# Altium project Assignment 1.PrjPcb
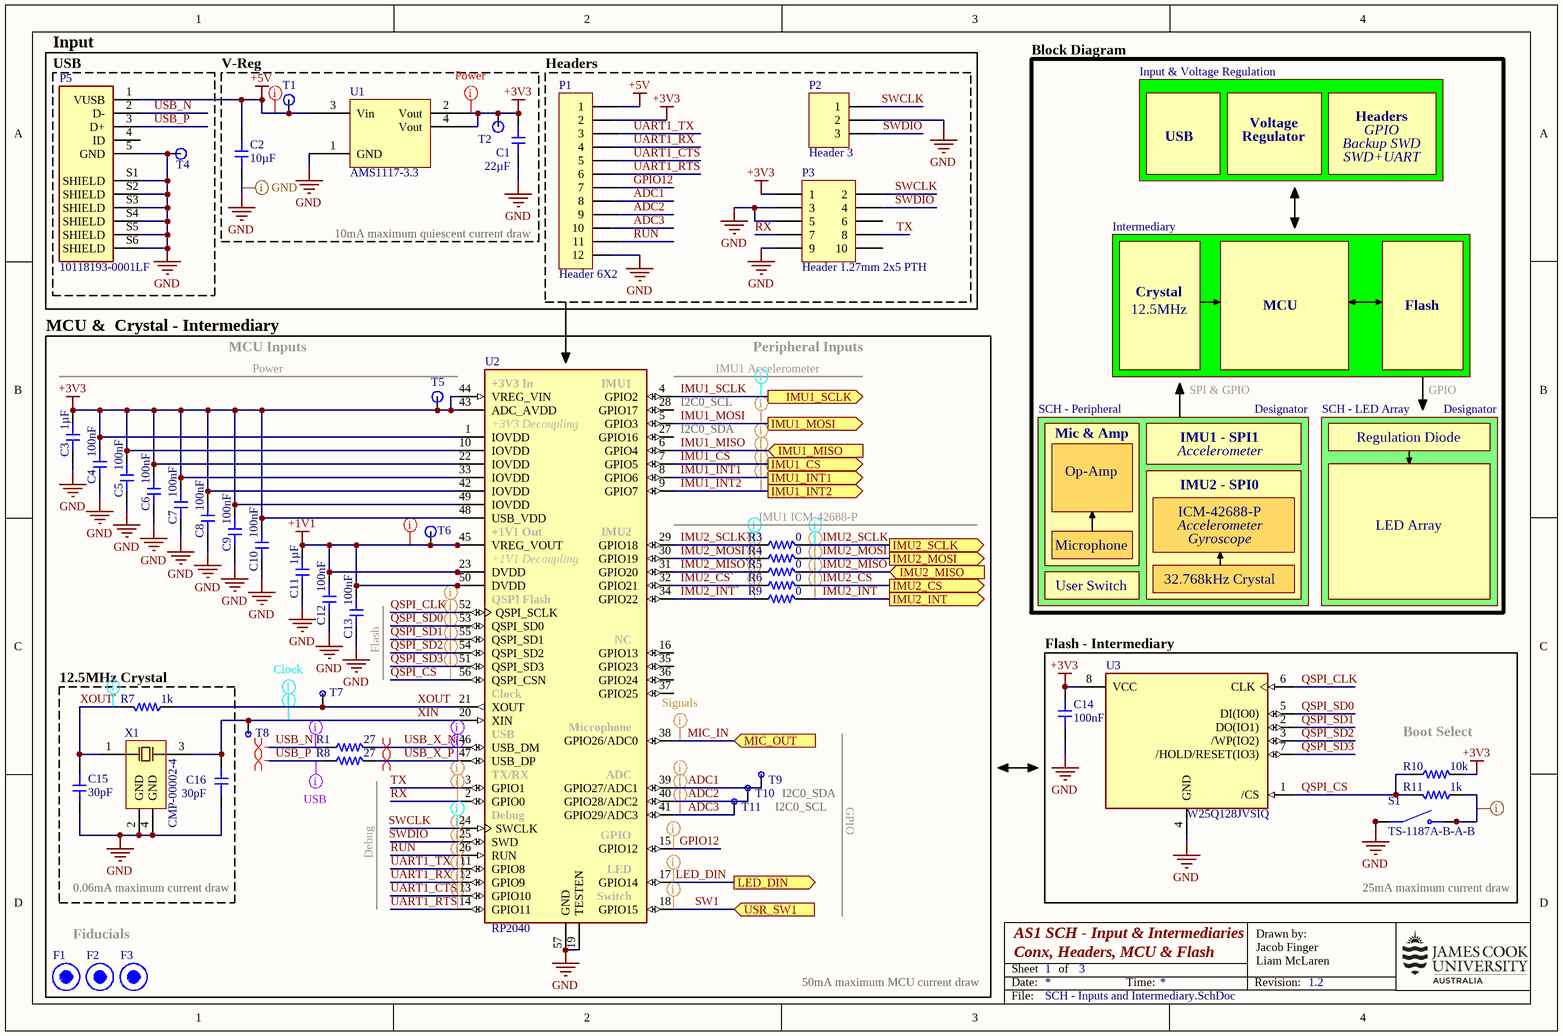
[diagram p0: SCH - Inputs and Intermediary.SchDoc]
3 sheets, 139 parts. Net scope: flat (ports and power ports of the same name join across sheets).
Board file: PCB - Assignment 1.PcbDoc
Sheets:
  SCH - Inputs and Intermediary.SchDoc
    Designator = SCH - Peripheral.SchDoc
    Designator = SCH - LED Array.SchDoc

## Sheet SCH - Inputs and Intermediary.SchDoc: *f
size A4; CompanyName: James Cook University; DrawnBy1: Jacob Finger; Organization: James Cook University; Title1: AS1 SCH - Input & Intermediaries; Revision: 1.2; SheetNumber: 1; SheetTotal: 3; Title2: Conx, Headers, MCU & Flash; DrawnBy2: Liam McLaren; ProjectName: *ProjectName

### Parts
C1  value 22µF  [CAP-0603]  (hidden comment: CL10A226MQ8NRNC)
C2  value 10µF  [CAP-0402]  (hidden comment: CL05A106MQ5NUNC)
C3  value 1µF  [CAP-0402]  (hidden comment: CL05A105KA5NQNC)
C4  value 100nF  [CAP-0402]  (hidden comment: CL05B104KB54PNC)
C5  value 100nF  [CAP-0402]  (hidden comment: CL05B104KB54PNC)
C6  value 100nF  [CAP-0402]  (hidden comment: CL05B104KB54PNC)
C7  value 100nF  [CAP-0402]  (hidden comment: CL05B104KB54PNC)
C8  value 100nF  [CAP-0402]  (hidden comment: CL05B104KB54PNC)
C9  value 100nF  [CAP-0402]  (hidden comment: CL05B104KB54PNC)
C10  value 100nF  [CAP-0402]  (hidden comment: CL05B104KB54PNC)
C11  value 1µF  [CAP-0402]  (hidden comment: CL05A105KA5NQNC)
C12  value 100nF  [CAP-0402]  (hidden comment: CL05B104KB54PNC)
C13  value 100nF  [CAP-0402]  (hidden comment: CL05B104KB54PNC)
C14  value 100nF  [CAP-0402]  (hidden comment: CL05B104KB54PNC)
C15  value 30pF  [CAP-0603]  (hidden comment: 0603CG300J500NT)
C16  value 30pF  [CAP-0603]  (hidden comment: 0603CG300J500NT)
F1  Fiducial Pad  [Fiducial]  (value not drawn)  (no BOM)
F2  Fiducial Pad  [Fiducial]  (value not drawn)  (no BOM)
F3  Fiducial Pad  [Fiducial]  (value not drawn)  (no BOM)
P1  Header 6X2  [HDR2X6]  (no BOM)
P2  Header 3  [HDR1X3]  (no BOM)
P3  Header 1.27mm 2x5 PTH  [Header 1.27mm 2x5 PTH]  (no BOM)
P5  10118193-0001LF  [FCI_10118193-0001LF]
R1  value 27  [RES-0603]  (hidden comment: 0603WAF270JT5E)
R3  value 0  [RES-0402]  (hidden comment: 0402WGF0000TCE)
R4  value 0  [RES-0402]  (hidden comment: 0402WGF0000TCE)
R5  value 0  [RES-0402]  (hidden comment: 0402WGF0000TCE)
R6  value 0  [RES-0402]  (hidden comment: 0402WGF0000TCE)
R7  value 1k  [RES-0402]  (hidden comment: 0402WGF1001TCE)
R8  value 27  [RES-0603]  (hidden comment: 0603WAF270JT5E)
R9  value 0  [RES-0402]  (hidden comment: 0402WGF0000TCE)
R10  value 10k  [RES-0402]  (hidden comment: 0402WGF1002TCE)
R11  value 1k  [RES-0402]  (hidden comment: 0402WGF1001TCE)
S1  TS-1187A-B-A-B  [SW_TS-1187A-B-A-B]
T1  TP  [TestPoint]  (value not drawn)  (no BOM)
T2  TP  [TestPoint]  (value not drawn)  (no BOM)
T4  TP  [TestPoint]  (value not drawn)  (no BOM)
T5  TP  [TestPoint]  (value not drawn)  (no BOM)
T6  TP  [TestPoint]  (value not drawn)  (no BOM)
T7  TP  [TestPoint - Small]  (value not drawn)  (no BOM)
T8  TP  [TestPoint - Small]  (value not drawn)  (no BOM)
T9  TP  [TestPoint - Small]  (value not drawn)  (no BOM)
T10  TP  [TestPoint - Small]  (value not drawn)  (no BOM)
T11  TP  [TestPoint - Small]  (value not drawn)  (no BOM)
U1  AMS1117-3.3  [SOT230P700X180-4N]
U2  RP2040  [QFN40P700X700X90-57N]
U3  W25Q128JVSIQ  [SOIC127P790X216-8N]
X1  CMP-00002-4  [X322512MSB4SI-Footprint-1]

### Blocks framed on the sheet
USB: P5 T4
V-Reg: C1 C2 T1 T2 U1
Headers: P1-P3
MCU &  Crystal - Intermediary: C3-C13 F1-F3 R1 R3-R6 R8 R9 T5-T11 U2
12.5MHz Crystal: C15 C16 R7 X1

### Sub-sheets
Designator = SCH - Peripheral: no entries
Designator = SCH - LED Array: no entries

### Ports
IMU1_CS (out, see SCH - Peripheral[4A]), IMU1_INT1 (out, see SCH - Peripheral[4B]), IMU1_INT2 (out, see SCH - Peripheral[4B]), IMU1_MISO (in, see SCH - Peripheral[4B]), IMU1_MOSI (out, see SCH - Peripheral[4A]), IMU1_SCLK (out, see SCH - Peripheral[4A]), IMU2_CS (out, see SCH - Peripheral[4C]), IMU2_INT (out, see SCH - Peripheral[3C]), IMU2_MISO (in, see SCH - Peripheral[4C]), IMU2_MOSI (out, see SCH - Peripheral[4C]), IMU2_SCLK (out, see SCH - Peripheral[4C]), LED_DIN (out, see SCH - LED Array[1A]), MIC_OUT (in, see SCH - Peripheral[2A]), USR_SW1 (in, see SCH - Peripheral[1C])

### Nets
+1V1: C11.1 C12.2 C13.2 T6.1(TP) U2.23(DVDD) U2.45(VREG_VOUT) U2.50(DVDD)
+3V3: C1.2 C3.2 C4.2 C5.2 C6.2 C7.2 C8.2 C9.2 C10.2 C14.2 P1.2 P3.1 R10.2 T2.1(TP) T5.1(TP) U1.2(Vout) U1.4(Vout) U2.1(IOVDD) U2.10(IOVDD) U2.22(IOVDD) U2.33(IOVDD) U2.42(IOVDD) U2.43(ADC_AVDD) U2.44(VREG_VIN) U2.48(USB_VDD) U2.49(IOVDD) U3.8(VCC)
+5V: C2.2 P1.1 P5.1(VUSB) T1.1(TP) U1.3(Vin)
GND: C1.1 C2.1 C3.1 C4.1 C5.1 C6.1 C7.1 C8.1 C9.1 C10.1 C11.2 C12.1 C13.1 C14.1 C15.1 C16.1 P1.12 P2.2 P3.3 P3.5 P3.9 P5.5(GND) P5.S1(SHIELD) P5.S2(SHIELD) P5.S3(SHIELD) P5.S4(SHIELD) P5.S5(SHIELD) P5.S6(SHIELD) S1.A(COM) S1.B(COM) T4.1(TP) U1.1(GND) U2.19(TESTEN) U2.57(GND) U3.4(GND) X1.2(GND) X1.4(GND)
ADC1: P1.8 T9.1(TP) U2.39(GPIO27/ADC1)
ADC2: P1.9 T10.1(TP) U2.40(GPIO28/ADC2)
ADC3: P1.10 T11.1(TP) U2.41(GPIO29/ADC3)
GPIO12: P1.7 U2.15(GPIO12)
IMU1_CS: U2.7(GPIO5) ; port IMU1_CS
IMU1_INT1: U2.8(GPIO6) ; port IMU1_INT1
IMU1_INT2: U2.9(GPIO7) ; port IMU1_INT2
IMU1_MISO: U2.6(GPIO4) ; port IMU1_MISO
IMU1_MOSI: U2.5(GPIO3) ; port IMU1_MOSI
IMU1_SCLK: U2.4(GPIO2) ; port IMU1_SCLK
IMU2_CS: R6.2 ; port IMU2_CS
IMU2_CS`: R6.1 U2.32(GPIO21)
IMU2_INT: R9.2 ; port IMU2_INT
IMU2_INT`: R9.1 U2.34(GPIO22)
IMU2_MISO: R5.2 ; port IMU2_MISO
IMU2_MISO`: R5.1 U2.31(GPIO20)
IMU2_MOSI: R4.2 ; port IMU2_MOSI
IMU2_MOSI`: R4.1 U2.30(GPIO19)
IMU2_SCLK: R3.2 ; port IMU2_SCLK
IMU2_SCLK`: R3.1 U2.29(GPIO18)
LED_DIN: U2.17(GPIO14) ; port LED_DIN
MIC_IN: U2.38(GPIO26/ADC0) ; port MIC_OUT
QSPI_CLK: U2.52(QSPI_SCLK) U3.6(CLK)
QSPI_CS: R10.1 R11.2 U2.56(QSPI_CSN) U3.1(/CS)
QSPI_SD0: U2.53(QSPI_SD0) U3.5(DI(IO0))
QSPI_SD1: U2.55(QSPI_SD1) U3.2(DO(IO1))
QSPI_SD2: U2.54(QSPI_SD2) U3.3(/WP(IO2))
QSPI_SD3: U2.51(QSPI_SD3) U3.7(/HOLD/RESET(IO3))
RUN: P1.11 U2.26(RUN)
RX: P3.7 U2.2(GPIO0)
SW1: U2.18(GPIO15) ; port USR_SW1
SWCLK: P2.1 P3.2 U2.24(SWCLK)
SWDIO: P2.3 P3.4 U2.25(SWD)
TX: P3.8 U2.3(GPIO1)
UART1_CTS: P1.5 U2.13(GPIO10)
UART1_RTS: P1.6 U2.14(GPIO11)
UART1_RX: P1.4 U2.12(GPIO9)
UART1_TX: P1.3 U2.11(GPIO8)
USB_N: P5.2(D-) R1.1
USB_P: P5.3(D+) R8.1
USB_X_N: R1.2 U2.46(USB_DM)
USB_X_P: R8.2 U2.47(USB_DP)
XIN: C16.2 T8.1(TP) U2.20(XIN) X1.3(OSC2)
XOUT: R7.1 T7.1(TP) U2.21(XOUT)
XOUT`: C15.2 R7.2 X1.1(OSC1)
NetR11_1: R11.1 S1.C(NO) S1.D(NO)

Not connected (* = marked no-connect by the designer): P3 6 10; P5 4(ID); U2 16(GPIO13) 27(GPIO16) 28(GPIO17) 35(GPIO23) 36(GPIO24) 37(GPIO25)

### Layout directives
differential pair: USB_N, USB_P, USB_X_N, USB_X_P
net class Power: +1V1, +3V3, +5V
net class Signals: ADC1, ADC2, ADC3, GPIO12, IMU1_CS, IMU1_INT1, IMU1_INT2, IMU1_MISO, IMU1_MOSI, IMU2_CS, IMU2_CS`, IMU2_INT, IMU2_INT`, IMU2_MISO, IMU2_MISO`, IMU2_MOSI, IMU2_MOSI`, LED_DIN, MIC_IN, RUN, RX, SW1, SWDIO, TX, UART1_CTS, UART1_RTS, UART1_RX, UART1_TX
net class QSPI: QSPI_CLK, QSPI_CS, QSPI_SD0, QSPI_SD1, QSPI_SD2, QSPI_SD3
net class Clock: IMU1_SCLK, IMU2_SCLK, IMU2_SCLK`, SWCLK, XIN, XOUT, XOUT`
net class GND: GND, NetR11_1
net class USB: USB_N, USB_P, USB_X_N, USB_X_P

### Notes on the sheet
- (near P5) Input
- Block Diagram
- Input & Voltage Regulation
- Voltage
- Headers
- GPIO
- USB
- Regulator
- Backup SWD
- SWD+UART
- 10mA maximum quiescent current draw
- Intermediary
- Crystal
- 12.5MHz
- MCU
- Flash
- MCU Inputs
- Power
- IMU1 Accelerometer
- Peripheral Inputs
- SPI & GPIO
- (near U2) I2C0_SDA
- (near U2) I2C0_SCL
- Mic & Amp
- IMU1 - SPI1
- Accelerometer
- Regulation Diode
- IMU1 ICM-42688-P
- Op-Amp
- IMU2 - SPI0
- ICM-42688-P
- LED Array
- User Switch
- Microphone
- 32.768kHz Crystal
- Gyroscope
- (near C13) Flash
- Flash - Intermediary
- Boot Select
- Debug
- I2C0_SCL
- I2C0_SDA
- 0.06mA maximum current draw
- 25mA maximum current draw
- Fiducials
- 50mA maximum MCU current draw
- Date:
- Sheet
- of
- Time:
- Revision:
- Drawn by:
- File:
- (in symbol CMP-043-000000-5) +3V3 In; IMU1; +3V3 Decoupling; +1V1 Out; IMU2; +1V1 Decoupling; QSPI Flash; NC; Clock; Microphone; USB; TX/RX; ADC; Debug; GPIO; LED; Switch

### Library data of the parts
C1 = CMP-001-00157-2: Capacitor, Ceramic (MLCC), 22uF, ±20%, 6.3V, X5R, ±20%, SMD 0603; Manufacturer: Samsung Electro-Mechanics; Manufacturer Part Number: CL10A226MQ8NRNC; JLCPCB Basic Part: Yes; ComponentLink1Description: Datasheet; ComponentLink2URL: https://jlcpcb.com/partdetail/C59461; ComponentLink3Description: LCSC Part URL; Case/Package: 0603; ComponentLink1URL: https://datasheet.lcsc.com/lcsc/1811151138_Samsung-Electro-Mechanics-CL10A226MQ8NRNC_C59461.pdf; Voltage Rating: 6.3V; Category: Capacitors - MLCC; Design Item ID: CL10A226MQ8NRNC; Source: jlcpcb_capacitors_basic.schlib; ComponentLink3URL: https://lcsc.com/product-detail/Multilayer-Ceramic-Capacitors-MLCC---SMD-SMT_Samsung-Electro-Mechanics-Samsung-Electro-Mechanics-CL10A226MQ8NRNC_C59461.html; ComponentLink2Description: JLCPCB Part URL; RoHS: Yes; JLCPCB Part Number: C59461; Tolerance: 20%; Temperature Coefficient: X5R
C2 = CMP-001-00141-3: Capacitor, Ceramic (MLCC), 10uF, ±20%, 6.3V, X5R, ±20%, SMD 0402; Manufacturer: Samsung Electro-Mechanics; JLCPCB Part Number: C15525; Tolerance: 20%; Temperature Coefficient: X5R; ComponentLink2Description: JLCPCB Part URL; ComponentLink3Description: LCSC Part URL; Voltage Rating: 6.3V; ComponentLink1Description: Datasheet; ComponentLink1URL: https://datasheet.lcsc.com/lcsc/2208231630_Samsung-Electro-Mechanics-CL05A106MQ5NUNC_C15525.pdf; RoHS: Yes; Case/Package: 0402; ComponentLink2URL: https://jlcpcb.com/partdetail/C15525; Manufacturer Part Number: CL05A106MQ5NUNC; Design Item ID: CL05A106MQ5NUNC; Source: jlcpcb_capacitors_basic.schlib; Category: Capacitors - MLCC; ComponentLink3URL: https://lcsc.com/product-detail/Multilayer-Ceramic-Capacitors-MLCC---SMD-SMT_Samsung-Electro-Mechanics-Samsung-Electro-Mechanics-CL05A106MQ5NUNC_C15525.html; JLCPCB Basic Part: Yes
C3 C11 = CMP-001-00140-3: Capacitor, Ceramic (MLCC), 1uF, ±10%, 25V, X5R, ±10%, SMD 0402; Manufacturer: Samsung Electro-Mechanics; Case/Package: 0402; JLCPCB Basic Part: Yes; ComponentLink2URL: https://jlcpcb.com/partdetail/C52923; Source: jlcpcb_capacitors_basic.schlib; ComponentLink1URL: https://datasheet.lcsc.com/lcsc/1811091611_Samsung-Electro-Mechanics-CL05A105KA5NQNC_C52923.pdf; RoHS: Yes; ComponentLink2Description: JLCPCB Part URL; Temperature Coefficient: X5R; ComponentLink3Description: LCSC Part URL; Category: Capacitors - MLCC; Voltage Rating: 25V; Tolerance: 10%; Design Item ID: CL05A105KA5NQNC; ComponentLink3URL: https://lcsc.com/product-detail/Multilayer-Ceramic-Capacitors-MLCC---SMD-SMT_Samsung-Electro-Mechanics-Samsung-Electro-Mechanics-CL05A105KA5NQNC_C52923.html; Manufacturer Part Number: CL05A105KA5NQNC; JLCPCB Part Number: C52923; ComponentLink1Description: Datasheet
C4-C10 C12-C14 = CMP-001-00146-3: Capacitor, Ceramic (MLCC), 100nF, ±10%, 50V, X7R, ±10%, SMD 0402; Manufacturer: Samsung Electro-Mechanics; Design Item ID: CL05B104KB54PNC; Source: jlcpcb_capacitors_basic.schlib; Case/Package: 0402; Temperature Coefficient: X7R; ComponentLink3URL: https://lcsc.com/product-detail/Multilayer-Ceramic-Capacitors-MLCC---SMD-SMT_Samsung-Electro-Mechanics-Samsung-Electro-Mechanics-CL05B104KB54PNC_C307331.html; Manufacturer Part Number: CL05B104KB54PNC; RoHS: Yes; ComponentLink1Description: Datasheet; Voltage Rating: 50V; ComponentLink2Description: JLCPCB Part URL; JLCPCB Basic Part: Yes; Category: Capacitors - MLCC; ComponentLink3Description: LCSC Part URL; ComponentLink2URL: https://jlcpcb.com/partdetail/C307331; JLCPCB Part Number: C307331; Tolerance: 10%; ComponentLink1URL: https://datasheet.lcsc.com/lcsc/1810191222_Samsung-Electro-Mechanics-CL05B104KB54PNC_C307331.pdf
C15 C16 = CMP-001-00132-2: Capacitor, Ceramic (MLCC), 30pF, ±5%, 50V, C0G, ±5%, SMD 0603; Manufacturer: FH(Guangdong Fenghua Advanced Tech); Voltage Rating: 50V; ComponentLink3URL: https://lcsc.com/product-detail/Multilayer-Ceramic-Capacitors-MLCC---SMD-SMT_FH-Guangdong-Fenghua-Advanced-Tech-FH-Guangdong-Fenghua-Advanced-Tech-0603CG300J500NT_C1658.html; JLCPCB Part Number: C1658; ComponentLink3Description: LCSC Part URL; Tolerance: 5%; ComponentLink2Description: JLCPCB Part URL; Category: Capacitors - MLCC; ComponentLink2URL: https://jlcpcb.com/partdetail/C1658; JLCPCB Basic Part: Yes; Source: jlcpcb_capacitors_basic.schlib; Temperature Coefficient: C0G; Case/Package: 0603; ComponentLink1URL: https://datasheet.lcsc.com/lcsc/1810261611_FH--Guangdong-Fenghua-Advanced-Tech-0603CG300J500NT_C1658.pdf; ComponentLink1Description: Datasheet; Design Item ID: 0603CG300J500NT; RoHS: Yes; Manufacturer Part Number: 0603CG300J500NT
F1-F3 = Fiducial: 1x2mm Fiducial Pad; ClassName: Fiducial; Component Class name: Fiducial
P1 = CMP-002-00136-1: Header, 6-Pin, Dual row; Signal Integrity: Connector; Component Type: Standard; LatestRevisionNote: Re-released for DXP Platform.; Publisher: Altium Limited; Design Item ID: Header 6X2; LatestRevisionDate: 17-Jul-2002; Pin Count: 12; Source: Miscellaneous Connectors.SchLib
P2 = CMP-002-00117-1: Header, 3-Pin; Signal Integrity: Connector; Design Item ID: Header 3; LatestRevisionDate: 17-Jul-2002; Publisher: Altium Limited; Component Type: Standard; Pin Count: 3; Source: Miscellaneous Connectors.SchLib; LatestRevisionNote: Re-released for DXP Platform.
P3 = CMP-005-0002-2: Header 1.27mm pitch, 2x5, PTH through hole; Pins: 10; element14 Item: 1577743; Design Item ID: Header 1.27mm 2x5 PTH; Source: JCULibrary.SchLib; Component Type: Standard
P5 = CMP-045-000000-8: USB - micro B USB 2.0 Receptacle Connector 5 Position Surface Mount, Right Angle; Through Hole; MF: Amphenol ICC; MP: 10118193-0001LF; Component Type: Standard; Design Item ID: 10118193-0001LF; JLCPCB Part: C132562; Pin Count: 11; Package: None; Source: SnapEDAsch.SchLib; SnapEDA_Link: https://www.snapeda.com/parts/10118193-0001LF/Amphenol%20FCI/view-part/2758989/?ref=snap
R1 R8 = CMP-009-00289-2: Resistor, 27Ω, ±1%, 100mW, 75V, ±200ppm/℃, -55℃~+155℃, SMD 0603; Manufacturer: Uniroyal; Design Item ID: 0603WAF270JT5E; Temperature Coefficient: ±200ppm/℃; ComponentLink1URL: https://datasheet.lcsc.com/lcsc/2205311845_UNI-ROYAL-Uniroyal-Elec-0603WAF270JT5E_C25190.pdf; ComponentLink2URL: https://jlcpcb.com/partdetail/C25190; Power Rating: 100mW; JLCPCB Part Number: C25190; Manufacturer Part Number: 0603WAF270JT5E; Source: jlcpcb_resistors_basic.schlib; Voltage Rating: 75V; Tolerance: 1%; Case/Package: 0603; Temperature Rating: -55℃~+155℃; ComponentLink1Description: Datasheet; Category: Resistors; ComponentLink2Description: JLCPCB Part URL; JLCPCB Basic Part: Yes
R3-R6 R9 = CMP-009-00178-4: Resistor, 0Ω, ±1%, 62.5mW, 50V, ±800ppm/℃, -55℃~+155℃, SMD 0402; Manufacturer: Uniroyal; JLCPCB Part Number: C17168; Tolerance: 1%; Temperature Coefficient: ±800ppm/℃; ComponentLink1Description: Datasheet; ComponentLink1URL: https://datasheet.lcsc.com/lcsc/2206010216_UNI-ROYAL-Uniroyal-Elec-0402WGF0000TCE_C17168.pdf; Manufacturer Part Number: 0402WGF0000TCE; Voltage Rating: 50V; Case/Package: 0402; ComponentLink2URL: https://jlcpcb.com/partdetail/C17168; Temperature Rating: -55℃~+155℃; ComponentLink2Description: JLCPCB Part URL; Power Rating: 62.5mW; Category: Resistors; Source: jlcpcb_resistors_basic.schlib; JLCPCB Basic Part: Yes; Design Item ID: 0402WGF0000TCE
R7 R11 = CMP-009-00180-4: Resistor, 1kΩ, ±1%, 62.5mW, 50V, ±100ppm/℃, -55℃~+155℃, SMD 0402; Manufacturer: Uniroyal; Temperature Coefficient: ±100ppm/℃; JLCPCB Part Number: C11702; ComponentLink2URL: https://jlcpcb.com/partdetail/C11702; Power Rating: 62.5mW; JLCPCB Basic Part: Yes; ComponentLink2Description: JLCPCB Part URL; ComponentLink1URL: https://datasheet.lcsc.com/lcsc/2206010216_UNI-ROYAL-Uniroyal-Elec-0402WGF1001TCE_C11702.pdf; Temperature Rating: -55℃~+155℃; Manufacturer Part Number: 0402WGF1001TCE; ComponentLink1Description: Datasheet; Tolerance: 1%; Source: jlcpcb_resistors_basic.schlib; Design Item ID: 0402WGF1001TCE; Case/Package: 0402; Voltage Rating: 50V; Category: Resistors
R10 = CMP-009-00181-4: Resistor, 10kΩ, ±1%, 62.5mW, 50V, ±100ppm/℃, -55℃~+155℃, SMD 0402; Manufacturer: Uniroyal; ComponentLink1Description: Datasheet; JLCPCB Basic Part: Yes; Temperature Rating: -55℃~+155℃; Power Rating: 62.5mW; ComponentLink2URL: https://jlcpcb.com/partdetail/C25744; ComponentLink2Description: JLCPCB Part URL; Case/Package: 0402; Voltage Rating: 50V; ComponentLink1URL: https://datasheet.lcsc.com/lcsc/2206010100_UNI-ROYAL-Uniroyal-Elec-0402WGF1002TCE_C25744.pdf; Source: jlcpcb_resistors_basic.schlib; Category: Resistors; Design Item ID: 0402WGF1002TCE; Temperature Coefficient: ±100ppm/℃; JLCPCB Part Number: C25744; Tolerance: 1%; Manufacturer Part Number: 0402WGF1002TCE
S1 = CMP-015-000000-1: SPST 50mA @ 12VDC Top Actuated Round Button 160gf SMD Tactile Switches RoHS; Availability: Unavailable; JLCPCB Part: C318884; Value: *; Price: None; Design Item ID: TS-1187A-B-A-B; Component Type: Standard; Pin Count: 4; Source: TS-1187A-B-A-B.SchLib; MP: TS-1187A-B-A-B; Package: None
T1 T2 T4-T6 = TestPoint
T7-T11 = TestPoint Small
U1 = CMP-00001-4: 3.3V 1A LOW DROPOUT VOLTAGE REGULATOR SOT-223; Dropout voltage: 1.3 V; JLCPCB Part: C6186; Output current: 1 A; Output voltage: 3.3 V
U2 = CMP-043-000000-5: ARM Cortex-M0+ MCU 32-Bit Microcontroller for Raspberry Pi Pico; Package: None; Price: None; Availability: Available; JLCPCB Part: C2040; Design Item ID: RP2040; Component Type: Standard; Pin Count: 57; Source: RP2040.SchLib; Value: *; MP: RP2040
U3 = CMP-031-00006-4: FLASH - NOR Memory IC 128Mb (16M x 8) SPI - Quad I/O, QPI, DTR 133 MHz 8-SOIC; MF: Winbond Electronics; Pin Count: 8; Check_prices: https://www.snapeda.com/parts/W25Q128JVSIQ/Winbond+Electronics/view-part/?ref=eda; Package: SOIC-8 Winbond; MP: W25Q128JVSIQ; Component Type: Standard; JLCPCB Part: C97521; Source: W25Q128JVSIQ.SchLib; Design Item ID: W25Q128JVSIQ; Purchase-URL: https://pricing.snapeda.com/search/part/W25Q128JVSIQ/?ref=eda; Price: None; Availability: In Stock; SnapEDA_Link: https://www.snapeda.com/parts/W25Q128JVSIQ/Winbond+Electronics/view-part/?ref=snap; Value: *
X1 = CMP-003-00030-1: 12MHz SMD Crystal Resonator 20pF ±10ppm ±30ppm -40℃~+85℃ SMD3225-4P  Crystals ROHS Yangxing Tech; Max ESR: 80 Ω; Design Item ID: CMP-00002-4; Source: SCH_LIB_Assignment1.SchLib; Load Capacitance: 20pF; Frequency: 12MHz; JLCPCB Part: C9002

## Sheet SCH - Peripheral.SchDoc
size A4; CompanyName: James Cook University; DrawnBy1: Jacob Finger; Organization: James Cook University; Title1: AS1 SCH - Peripherals; Revision: 1.2; SheetNumber: 2; SheetTotal: 3; Title2: Mic, Oscillator, IMUs & Switch; DrawnBy2: Liam McLaren; ProjectName: *ProjectName
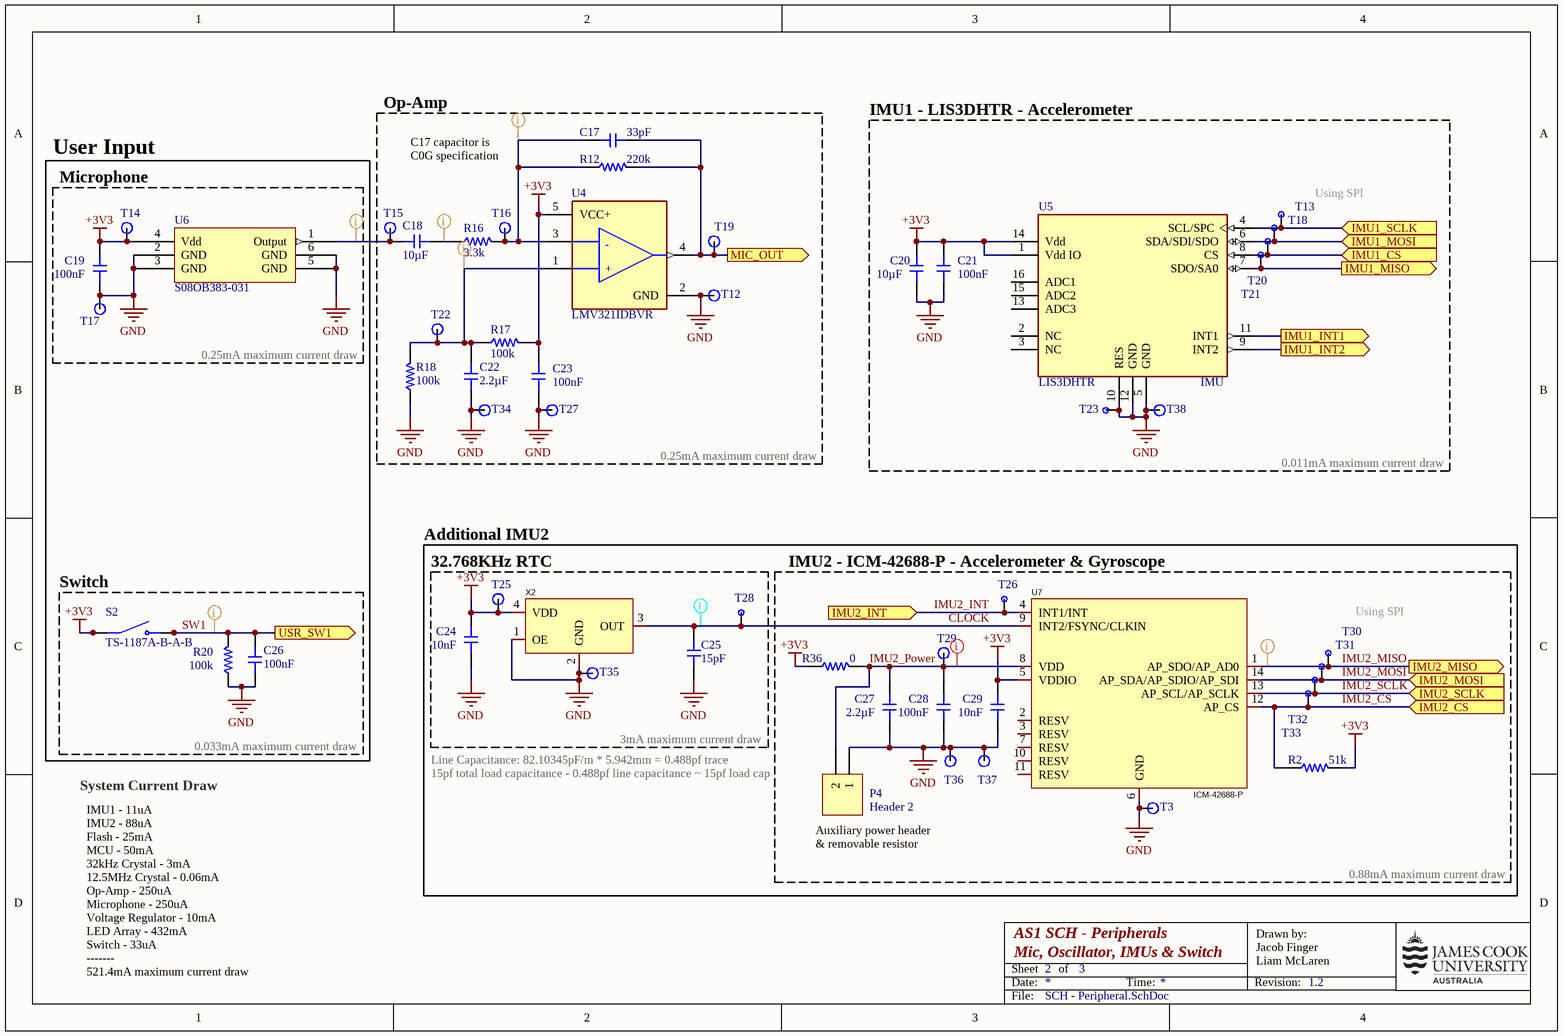
[diagram p1: SCH - Peripheral.SchDoc]

### Parts
C17  value 33pF  [CAP-0402]  (hidden comment: 0402CG330J500NT)
C18  value 10µF  [CAP-0402]  (hidden comment: CL05A106MQ5NUNC)
C19  value 100nF  [CAP-0402]  (hidden comment: CL05B104KB54PNC)
C20  value 10µF  [CAP-0402]  (hidden comment: CL05A106MQ5NUNC)
C21  value 100nF  [CAP-0402]  (hidden comment: CL05B104KB54PNC)
C22  value 2.2µF  [CAP-0402]  (hidden comment: CL05A225MQ5NSNC)
C23  value 100nF  [CAP-0402]  (hidden comment: CL05B104KB54PNC)
C24  value 10nF  [CAP-0402]  (hidden comment: CL05B103KB5NNNC)
C25  value 15pF  [CAP-0402]  (hidden comment: 0402CG150J500NT)
C26  value 100nF  [CAP-0402]  (hidden comment: CL05B104KO5NNNC)
C27  value 2.2µF  [CAP-0402]  (hidden comment: CL05A225MQ5NSNC)
C28  value 100nF  [CAP-0402]  (hidden comment: CL05B104KB54PNC)
C29  value 10nF  [CAP-0402]  (hidden comment: CL05B103KB5NNNC)
P4  Header 2  [HDR1X2]  (no BOM)
R2  value 51k  [RES-0402]  (hidden comment: 0402WGF5102TCE)
R12  value 220k  [RES-0603]  (hidden comment: 0603WAF2203T5E)
R16  value 3.3k  [RES-0402]  (hidden comment: 0402WGF3301TCE)
R17  value 100k  [RES-0402]  (hidden comment: 0402WGF1003TCE)
R18  value 100k  [RES-0402]  (hidden comment: 0402WGF1003TCE)
R20  value 100k  [RES-0402]  (hidden comment: 0402WGF1003TCE)
R36  value 0  [RES-0402]  (hidden comment: 0402WGF0000TCE)
S2  TS-1187A-B-A-B  [SW_TS-1187A-B-A-B]
T3  TP  [TestPoint]  (value not drawn)  (no BOM)
T12  TP  [TestPoint]  (value not drawn)  (no BOM)
T13  TP  [TestPoint - Small]  (value not drawn)  (no BOM)
T14  TP  [TestPoint]  (value not drawn)  (no BOM)
T15  TP  [TestPoint]  (value not drawn)  (no BOM)
T16  TP  [TestPoint]  (value not drawn)  (no BOM)
T17  TP  [TestPoint]  (value not drawn)  (no BOM)
T18  TP  [TestPoint - Small]  (value not drawn)  (no BOM)
T19  TP  [TestPoint]  (value not drawn)  (no BOM)
T20  TP  [TestPoint - Small]  (value not drawn)  (no BOM)
T21  TP  [TestPoint - Small]  (value not drawn)  (no BOM)
T22  TP  [TestPoint]  (value not drawn)  (no BOM)
T23  TP  [TestPoint - Small]  (value not drawn)  (no BOM)
T25  TP  [TestPoint]  (value not drawn)  (no BOM)
T26  TP  [TestPoint - Small]  (value not drawn)  (no BOM)
T27  TP  [TestPoint]  (value not drawn)  (no BOM)
T28  TP  [TestPoint - Small]  (value not drawn)  (no BOM)
T29  TP  [TestPoint]  (value not drawn)  (no BOM)
T30  TP  [TestPoint - Small]  (value not drawn)  (no BOM)
T31  TP  [TestPoint - Small]  (value not drawn)  (no BOM)
T32  TP  [TestPoint - Small]  (value not drawn)  (no BOM)
T33  TP  [TestPoint - Small]  (value not drawn)  (no BOM)
T34  TP  [TestPoint]  (value not drawn)  (no BOM)
T35  TP  [TestPoint]  (value not drawn)  (no BOM)
T36  TP  [TestPoint]  (value not drawn)  (no BOM)
T37  TP  [TestPoint]  (value not drawn)  (no BOM)
T38  TP  [TestPoint]  (value not drawn)  (no BOM)
U4  LMV321IDBVR  [FP-DBV0005A-MFG]
U5  LIS3DHTR  [FP-LGA-16-7983231-MFG]
U6  S08OB383-031  [Goertek_S08OB381-026]
U7  IMU IC  [LGA-14_L3.0-W2.5-P0.50-TL]  (value not drawn)
X2  HSO221S RTC  [OSC-SMD_4P-L2.5-W2.0-BL]  (value not drawn)

### Blocks framed on the sheet
Op-Amp: C17 C18 C22 C23 R12 R16-R18 T12 T15 T16 T19 T22 T27 T34 U4
IMU1 - LIS3DHTR - Accelerometer: C20 C21 T13 T18 T20 T21 T23 T38 U5
Microphone: C19 T14 T17 U6
Switch: C26 R20 S2
32.768KHz RTC: C24 C25 T25 T28 T35 X2
IMU2 - ICM-42688-P - Accelerometer & Gyroscope: C27-C29 P4 R2 R36 T3 T26 T29-T33 T36 T37 U7

### Ports
IMU1_CS (in, see SCH - Inputs and Intermediary[2B]), IMU1_INT1 (out, see SCH - Inputs and Intermediary[2B]), IMU1_INT2 (out, see SCH - Inputs and Intermediary[2B]), IMU1_MISO (out, see SCH - Inputs and Intermediary[2B]), IMU1_MOSI (in, see SCH - Inputs and Intermediary[2B]), IMU1_SCLK (in, see SCH - Inputs and Intermediary[2B]), IMU2_CS (in, see SCH - Inputs and Intermediary[3C]), IMU2_INT (in, see SCH - Inputs and Intermediary[3C]), IMU2_MISO (out, see SCH - Inputs and Intermediary[3C]), IMU2_MOSI (in, see SCH - Inputs and Intermediary[3C]), IMU2_SCLK (in, see SCH - Inputs and Intermediary[3C]), MIC_OUT (out, see SCH - Inputs and Intermediary[2C]), USR_SW1 (out, see SCH - Inputs and Intermediary[2D])

### Nets
+3V3: C19.2 C20.1 C21.2 C23.2 C24.2 C29.2 R2.2 R17.2 R36.1 S2.A(COM) S2.B(COM) T14.1(TP) T25.1(TP) U4.5(VCC+) U5.1(Vdd_IO) U5.14(Vdd) U6.4(Vdd) U7.5(VDDIO) X2.4(VDD)
GND: C19.1 C20.2 C21.1 C22.1 C23.1 C24.1 C25.1 C26.1 C27.1 C28.1 C29.1 P4.1 R18.1 R20.1 T3.1(TP) T12.1(TP) T17.1(TP) T23.1(TP) T27.1(TP) T34.1(TP) T35.1(TP) T36.1(TP) T37.1(TP) T38.1(TP) U4.2(GND) U5.5(GND) U5.10(RES) U5.12(GND) U6.2(GND) U6.3(GND) U6.5(GND) U6.6(GND) U7.6(GND) X2.1(OE) X2.2(GND)
CLOCK: C25.2 T28.1(TP) U7.9(INT2/FSYNC/CLKIN) X2.3(OUT)
IMU1_CS: T20.1(TP) U5.8(CS) ; port IMU1_CS
IMU1_INT1: U5.11(INT1) ; port IMU1_INT1
IMU1_INT2: U5.9(INT2) ; port IMU1_INT2
IMU1_MISO: T21.1(TP) U5.7(SDO/SA0) ; port IMU1_MISO
IMU1_MOSI: T18.1(TP) U5.6(SDA/SDI/SDO) ; port IMU1_MOSI
IMU1_SCLK: T13.1(TP) U5.4(SCL/SPC) ; port IMU1_SCLK
IMU2_CS: R2.1 T33.1(TP) U7.12(AP_CS) ; port IMU2_CS
IMU2_INT: T26.1(TP) U7.4(INT1/INT) ; port IMU2_INT
IMU2_MISO: T30.1(TP) U7.1(AP_SDO/AP_AD0) ; port IMU2_MISO
IMU2_MOSI: T31.1(TP) U7.14(AP_SDA/AP_SDIO/AP_SDI) ; port IMU2_MOSI
IMU2_Power: C27.2 C28.2 P4.2 R36.2 T29.1(TP) U7.8(VDD)
IMU2_SCLK: T32.1(TP) U7.13(AP_SCL/AP_SCLK) ; port IMU2_SCLK
MIC_IN: C17.2 R12.2 T19.1(TP) U4.4(OUT) ; port MIC_OUT
SW1: C26.2 R20.2 S2.C(NO) S2.D(NO) ; port USR_SW1
NetC17_1: C17.1 R12.1 R16.2 T16.1(TP) U4.3(1IN-)
NetC18_1: C18.1 T15.1(TP) U6.1(Output)
NetC18_2: C18.2 R16.1
NetC22_2: C22.2 R17.1 R18.2 T22.1(TP) U4.1(1IN+)

Not connected (* = marked no-connect by the designer): U5 2(NC) 3(NC) 13(ADC3) 15(ADC2) 16(ADC1); U7 2(RESV) 3(RESV) 7(RESV) 10(RESV) 11(RESV)

### Layout directives
net class Signals: IMU2_MISO, NetC17_1, NetC18_1, NetC18_2, NetC22_2, SW1
net class Clock: CLOCK
net class Power: IMU2_Power

### Notes on the sheet
- User Input
- C17 capacitor is C0G specification
- Using SPI
- (near R18) 0.25mA maximum current draw
- (near U5) IMU
- 0.25mA maximum current draw
- 0.011mA maximum current draw
- Additional IMU2
- System Current Draw
- 0.033mA maximum current draw
- (near P4) 15pf total load capacitance - 0.488pf line capacitance ~ 15pf load cap
- Line Capacitance: 82.10345pF/m * 5.942mm = 0.488pf trace
- 3mA maximum current draw
- Auxiliary power header & removable resistor
- 0.88mA maximum current draw
- IMU1 - 11uA
  IMU2 - 88uA
  Flash - 25mA
  MCU - 50mA
  32kHz Crystal - 3mA
  12.5MHz Crystal - 0.06mA
  Op-Amp - 250uA
  Microphone - 250uA
  Voltage Regulator - 10mA
  LED Array - 432mA
  Switch - 33uA
  -------
  521.4mA maximum current draw
- Date:
- Sheet
- of
- Time:
- Revision:
- Drawn by:
- File:
- (in symbol CMP-00012-2) +

### Library data of the parts
C17 = CMP-001-00127-3: Capacitor, Ceramic (MLCC), 33pF, ±5%, 50V, C0G, ±5%, SMD 0402; Manufacturer: FH(Guangdong Fenghua Advanced Tech); ComponentLink3URL: https://lcsc.com/product-detail/Multilayer-Ceramic-Capacitors-MLCC---SMD-SMT_FH-Guangdong-Fenghua-Advanced-Tech-FH-Guangdong-Fenghua-Advanced-Tech-0402CG330J500NT_C1562.html; Tolerance: 5%; ComponentLink1URL: https://datasheet.lcsc.com/lcsc/1811141731_FH--Guangdong-Fenghua-Advanced-Tech-0402CG330J500NT_C1562.pdf; Source: jlcpcb_capacitors_basic.schlib; ComponentLink2URL: https://jlcpcb.com/partdetail/C1562; ComponentLink2Description: JLCPCB Part URL; RoHS: Yes; Design Item ID: 0402CG330J500NT; Manufacturer Part Number: 0402CG330J500NT; Voltage Rating: 50V; JLCPCB Basic Part: Yes; Case/Package: 0402; Category: Capacitors - MLCC; ComponentLink3Description: LCSC Part URL; JLCPCB Part Number: C1562; ComponentLink1Description: Datasheet; Temperature Coefficient: C0G
C18 C20 = CMP-001-00141-3: as C2 on sheet SCH - Inputs and Intermediary; JLCPCB Part Number: C15525; Tolerance: 20%; Temperature Coefficient: X5R; ComponentLink2Description: JLCPCB Part URL; ComponentLink3Description: LCSC Part URL; Voltage Rating: 6.3V; ComponentLink1Description: Datasheet; ComponentLink1URL: https://datasheet.lcsc.com/lcsc/2208231630_Samsung-Electro-Mechanics-CL05A106MQ5NUNC_C15525.pdf; RoHS: Yes; Case/Package: 0402; ComponentLink2URL: https://jlcpcb.com/partdetail/C15525; Manufacturer Part Number: CL05A106MQ5NUNC; Design Item ID: CL05A106MQ5NUNC; Source: jlcpcb_capacitors_basic.schlib; Category: Capacitors - MLCC; ComponentLink3URL: https://lcsc.com/product-detail/Multilayer-Ceramic-Capacitors-MLCC---SMD-SMT_Samsung-Electro-Mechanics-Samsung-Electro-Mechanics-CL05A106MQ5NUNC_C15525.html; JLCPCB Basic Part: Yes
C19 C21 C23 C28 = CMP-001-00146-3: as C4 on sheet SCH - Inputs and Intermediary; Design Item ID: CL05B104KB54PNC; Source: jlcpcb_capacitors_basic.schlib; Case/Package: 0402; Temperature Coefficient: X7R; ComponentLink3URL: https://lcsc.com/product-detail/Multilayer-Ceramic-Capacitors-MLCC---SMD-SMT_Samsung-Electro-Mechanics-Samsung-Electro-Mechanics-CL05B104KB54PNC_C307331.html; Manufacturer Part Number: CL05B104KB54PNC; RoHS: Yes; ComponentLink1Description: Datasheet; Voltage Rating: 50V; ComponentLink2Description: JLCPCB Part URL; JLCPCB Basic Part: Yes; Category: Capacitors - MLCC; ComponentLink3Description: LCSC Part URL; ComponentLink2URL: https://jlcpcb.com/partdetail/C307331; JLCPCB Part Number: C307331; Tolerance: 10%; ComponentLink1URL: https://datasheet.lcsc.com/lcsc/1810191222_Samsung-Electro-Mechanics-CL05B104KB54PNC_C307331.pdf
C22 C27 = CMP-001-00142-3: Capacitor, Ceramic (MLCC), 2.2uF, ±20%, 6.3V, X5R, ±20%, SMD 0402; Manufacturer: Samsung Electro-Mechanics; Manufacturer Part Number: CL05A225MQ5NSNC; ComponentLink2URL: https://jlcpcb.com/partdetail/C12530; ComponentLink3URL: https://lcsc.com/product-detail/Multilayer-Ceramic-Capacitors-MLCC---SMD-SMT_Samsung-Electro-Mechanics-Samsung-Electro-Mechanics-CL05A225MQ5NSNC_C12530.html; RoHS: Yes; Design Item ID: CL05A225MQ5NSNC; Tolerance: 20%; JLCPCB Part Number: C12530; ComponentLink1Description: Datasheet; ComponentLink2Description: JLCPCB Part URL; ComponentLink1URL: https://datasheet.lcsc.com/lcsc/1811021410_Samsung-Electro-Mechanics-CL05A225MQ5NSNC_C12530.pdf; Voltage Rating: 6.3V; Case/Package: 0402; Source: jlcpcb_capacitors_basic.schlib; Category: Capacitors - MLCC; JLCPCB Basic Part: Yes; Temperature Coefficient: X5R; ComponentLink3Description: LCSC Part URL
C24 C29 = CMP-001-00145-3: Capacitor, Ceramic (MLCC), 10nF, ±10%, 50V, X7R, ±10%, SMD 0402; Manufacturer: Samsung Electro-Mechanics; JLCPCB Basic Part: Yes; JLCPCB Part Number: C15195; Case/Package: 0402; Voltage Rating: 50V; Design Item ID: CL05B103KB5NNNC; Category: Capacitors - MLCC; Tolerance: 10%; ComponentLink2Description: JLCPCB Part URL; ComponentLink3URL: https://lcsc.com/product-detail/Multilayer-Ceramic-Capacitors-MLCC---SMD-SMT_Samsung-Electro-Mechanics-Samsung-Electro-Mechanics-CL05B103KB5NNNC_C15195.html; ComponentLink2URL: https://jlcpcb.com/partdetail/C15195; Temperature Coefficient: X7R; Manufacturer Part Number: CL05B103KB5NNNC; ComponentLink1Description: Datasheet; Source: jlcpcb_capacitors_basic.schlib; ComponentLink3Description: LCSC Part URL; RoHS: Yes; ComponentLink1URL: https://datasheet.lcsc.com/lcsc/1810191223_Samsung-Electro-Mechanics-CL05B103KB5NNNC_C15195.pdf
C25 = CMP-001-00117-3: Capacitor, Ceramic (MLCC), 15pF, ±5%, 50V, C0G, ±5%, SMD 0402; Manufacturer: FH(Guangdong Fenghua Advanced Tech); Tolerance: 5%; Manufacturer Part Number: 0402CG150J500NT; ComponentLink3Description: LCSC Part URL; RoHS: Yes; Case/Package: 0402; JLCPCB Part Number: C1548; ComponentLink1Description: Datasheet; Source: jlcpcb_capacitors_basic.schlib; JLCPCB Basic Part: Yes; ComponentLink2URL: https://jlcpcb.com/partdetail/C1548; Voltage Rating: 50V; ComponentLink1URL: https://datasheet.lcsc.com/lcsc/1810111610_FH--Guangdong-Fenghua-Advanced-Tech-0402CG150J500NT_C1548.pdf; Category: Capacitors - MLCC; Design Item ID: 0402CG150J500NT; Temperature Coefficient: C0G; ComponentLink3URL: https://lcsc.com/product-detail/Multilayer-Ceramic-Capacitors-MLCC---SMD-SMT_FH-Guangdong-Fenghua-Advanced-Tech-FH-Guangdong-Fenghua-Advanced-Tech-0402CG150J500NT_C1548.html; ComponentLink2Description: JLCPCB Part URL
C26 = CMP-001-00147-3: Capacitor, Ceramic (MLCC), 100nF, ±10%, 16V, X7R, ±10%, SMD 0402; Manufacturer: Samsung Electro-Mechanics; Manufacturer Part Number: CL05B104KO5NNNC; ComponentLink1Description: Datasheet; RoHS: Yes; Voltage Rating: 16V; ComponentLink2URL: https://jlcpcb.com/partdetail/C1525; Temperature Coefficient: X7R; ComponentLink2Description: JLCPCB Part URL; JLCPCB Part Number: C1525; ComponentLink3URL: https://lcsc.com/product-detail/Multilayer-Ceramic-Capacitors-MLCC---SMD-SMT_Samsung-Electro-Mechanics-Samsung-Electro-Mechanics-CL05B104KO5NNNC_C1525.html; ComponentLink3Description: LCSC Part URL; Source: jlcpcb_capacitors_basic.schlib; Design Item ID: CL05B104KO5NNNC; Category: Capacitors - MLCC; ComponentLink1URL: https://datasheet.lcsc.com/lcsc/1810191219_Samsung-Electro-Mechanics-CL05B104KO5NNNC_C1525.pdf; JLCPCB Basic Part: Yes; Tolerance: 10%; Case/Package: 0402
P4 = CMP-002-00097-1: Header, 2-Pin; Signal Integrity: Connector; LatestRevisionDate: 17-Jul-2002; Publisher: Altium Limited; Pin Count: 2; Design Item ID: Header 2; LatestRevisionNote: Re-released for DXP Platform.; Source: Miscellaneous Connectors.SchLib; Component Type: Standard
R2 = CMP-009-00226-4: Resistor, 51kΩ, ±1%, 62.5mW, 50V, ±100ppm/℃, -55℃~+155℃, SMD 0402; Manufacturer: Uniroyal; ComponentLink2URL: https://jlcpcb.com/partdetail/C25794; ComponentLink2Description: JLCPCB Part URL; Case/Package: 0402; Manufacturer Part Number: 0402WGF5102TCE; ComponentLink1Description: Datasheet; Source: jlcpcb_resistors_basic.schlib; JLCPCB Part Number: C25794; Power Rating: 62.5mW; Temperature Rating: -55℃~+155℃; Design Item ID: 0402WGF5102TCE; JLCPCB Basic Part: Yes; Category: Resistors; Voltage Rating: 50V; Tolerance: 1%; Temperature Coefficient: ±100ppm/℃; ComponentLink1URL: https://datasheet.lcsc.com/lcsc/2206010100_UNI-ROYAL-Uniroyal-Elec-0402WGF5102TCE_C25794.pdf
R12 = CMP-009-00277-2: Resistor, 220kΩ, ±1%, 100mW, 75V, ±100ppm/℃, -55℃~+155℃, SMD 0603; Manufacturer: Uniroyal; Temperature Coefficient: ±100ppm/℃; Tolerance: 1%; ComponentLink2URL: https://jlcpcb.com/partdetail/C22961; Source: jlcpcb_resistors_basic.schlib; Case/Package: 0603; Category: Resistors; Manufacturer Part Number: 0603WAF2203T5E; Voltage Rating: 75V; Design Item ID: 0603WAF2203T5E; ComponentLink1URL: https://datasheet.lcsc.com/lcsc/2206010130_UNI-ROYAL-Uniroyal-Elec-0603WAF2203T5E_C22961.pdf; JLCPCB Part Number: C22961; Power Rating: 100mW; ComponentLink1Description: Datasheet; ComponentLink2Description: JLCPCB Part URL; Temperature Rating: -55℃~+155℃; JLCPCB Basic Part: Yes
R16 = CMP-009-00211-4: Resistor, 3.3kΩ, ±1%, 62.5mW, 50V, ±100ppm/℃, -55℃~+155℃, SMD 0402; Manufacturer: Uniroyal; JLCPCB Part Number: C25890; Design Item ID: 0402WGF3301TCE; Temperature Rating: -55℃~+155℃; Voltage Rating: 50V; JLCPCB Basic Part: Yes; Power Rating: 62.5mW; Source: jlcpcb_resistors_basic.schlib; ComponentLink2Description: JLCPCB Part URL; Temperature Coefficient: ±100ppm/℃; Case/Package: 0402; ComponentLink1URL: https://datasheet.lcsc.com/lcsc/2206010045_UNI-ROYAL-Uniroyal-Elec-0402WGF3301TCE_C25890.pdf; Manufacturer Part Number: 0402WGF3301TCE; ComponentLink2URL: https://jlcpcb.com/partdetail/C25890; ComponentLink1Description: Datasheet; Category: Resistors; Tolerance: 1%
R17 R18 R20 = CMP-009-00182-4: Resistor, 100kΩ, ±1%, 62.5mW, 50V, ±100ppm/℃, -55℃~+155℃, SMD 0402; Manufacturer: Uniroyal; ComponentLink1Description: Datasheet; Voltage Rating: 50V; ComponentLink2URL: https://jlcpcb.com/partdetail/C25741; Design Item ID: 0402WGF1003TCE; Tolerance: 1%; Case/Package: 0402; Manufacturer Part Number: 0402WGF1003TCE; ComponentLink2Description: JLCPCB Part URL; Source: jlcpcb_resistors_basic.schlib; JLCPCB Basic Part: Yes; Temperature Coefficient: ±100ppm/℃; Category: Resistors; Temperature Rating: -55℃~+155℃; JLCPCB Part Number: C25741; ComponentLink1URL: https://datasheet.lcsc.com/lcsc/2206010100_UNI-ROYAL-Uniroyal-Elec-0402WGF1003TCE_C25741.pdf; Power Rating: 62.5mW
R36 = CMP-009-00178-4: as R3 on sheet SCH - Inputs and Intermediary; JLCPCB Part Number: C17168; Tolerance: 1%; Temperature Coefficient: ±800ppm/℃; ComponentLink1Description: Datasheet; ComponentLink1URL: https://datasheet.lcsc.com/lcsc/2206010216_UNI-ROYAL-Uniroyal-Elec-0402WGF0000TCE_C17168.pdf; Manufacturer Part Number: 0402WGF0000TCE; Voltage Rating: 50V; Case/Package: 0402; ComponentLink2URL: https://jlcpcb.com/partdetail/C17168; Temperature Rating: -55℃~+155℃; ComponentLink2Description: JLCPCB Part URL; Power Rating: 62.5mW; Category: Resistors; Source: jlcpcb_resistors_basic.schlib; JLCPCB Basic Part: Yes; Design Item ID: 0402WGF0000TCE
S2 = CMP-015-000000-1: as S1 on sheet SCH - Inputs and Intermediary; Availability: Unavailable; JLCPCB Part: C318884; Value: *; Price: None; Design Item ID: TS-1187A-B-A-B; Component Type: Standard; Pin Count: 4; Source: TS-1187A-B-A-B.SchLib; MP: TS-1187A-B-A-B; Package: None
T3 T12 T14-T17 T19 T22 T25 T27 T29 T34-T38 = TestPoint
T13 T18 T20 T21 T23 T26 T28 T30-T33 = TestPoint Small
U4 = CMP-00012-2: General Purpose Amplifier 1 Circuit Rail-to-Rail SOT-23-5; Input Offset Voltage (Vos): 7mV; Number of Amplifiers: 1; Input Bias Current: 250nA; Max Supply Voltage: 5.5V; Min Supply Voltage: 2.7V; Voltage Gain: 100dB; Supply Current: 250uA; Operating Supply Current: 130uA; Output Current: 160mA; Power Supply Rejection Ratio (PSRR): 50dB; Unity Gain Bandwidth Product: 1MHz; Slew Rate: 1V/µs; Radiation Hardening: No; Case/Package: SOT-23-5; Amplifier Type: GENERAL PURPOSE; Contact Plating: Tin,Matte; Packaging: Tape and Reel; Number of Circuits: 1; Nominal Supply Current: 250uA; Mount: Surface Mount; Technology: BICMOS; JLCPCB Part: C7972; Series: -; REACH SVHC: No SVHC; Output Current per Channel: 160mA; Max Operating Temperature: 125°C; Number of Elements: 1; Number of Channels: 1; Number of Pins: 5; Lead Free: Lead Free; Bandwidth: 1MHz; Gain Bandwidth Product: 1MHz; RoHS Compliant: Yes; Min Operating Temperature: -40°C; Common Mode Rejection Ratio: 50dB; Package Quantity: 1
U5 = CMP-00010-2: ACCEL 2-16G I2C/SPI 16LGA; Interface: I2C; Max Supply Voltage: 3.6V; Axis: X, Y, Z; Operating Supply Voltage: 2.5V; Bandwidth: 5kHz; Resolution: 16b; Operating Supply Current: 11uA; Sensor Type: 3 Axis; Min Supply Voltage: 1.71V; Output Type: Digital; Series: -; Number of Pins: 16; Radiation Hardening: No; Package Quantity: 1; Case/Package: LGA; Contact Plating: Gold; Min Operating Temperature: -40°C; REACH SVHC: No SVHC; RoHS Compliant: Yes; Lead Free: Lead Free; Min Supply Voltage (DC): 1.71V; Length: 3mm; JLCPCB Part: C15134; Height: 1mm; Max Supply Voltage (DC): 3.6V; Width: 3mm; Max Operating Temperature: 85°C; Depth: 3mm; Packaging: Tape and Reel
U6 = CMP-00027-00000-1: MEMS Microphone SMD 3.76x3x1.1mm; JLCPCB Part: C233789
U7 = ICM-42688-P: ICM-42688-P LGA-14(2.5x3) Attitude Sensor/Gyroscope; Manufacturer: TDK InvenSense(应美盛); Add into BOM: yes; Sensor Type: 加速度计陀螺仪; LCSC Part Name: ICM-42688-P; Supplier Part: C1850418; Manufacturer Part: ICM-42688-P; JLCPCB Part Class: Extended Part; Datasheet: https://atta.szlcsc.com/upload/public/pdf/source/20210703/CF24204867ACE5B754A2B035F23E5931.pdf; Supplier: LCSC; Convert to PCB: yes; Device: ICM-42688-P; Symbol: ICM-42688-P; LCSC Part #: C1850418; JLCPCB Part #: C1850418; Supplier Footprint: LGA-14(2.5x3)
X2 = S2H32768KF3CHC-IT: HSO221S RTC - 3.3V 3mA ±30ppm 32.768kHz SMD2520-4P Oscillators ROHS; Manufacturer: HELE(台湾加高); Add into BOM: yes; Symbol: S2H32768KF3CHC-IT; Device: S2H32768KF3CHC-IT; LCSC Part Name: S2H32768KF3CHC-IT; Supplier Part: C253914; Manufacturer Part: S2H32768KF3CHC-IT; JLCPCB Part Class: Extended Part; Datasheet: https://atta.szlcsc.com/upload/public/pdf/source/20190430/C253914_C770A64EFF6E6E62846100D666617C6C.pdf; Supplier: LCSC; Convert to PCB: yes; Value: 32.768kHz; Supply Voltage: 3.3V; Supply Current (Max): 3mA; Frequency Stability(Full temperature range): ±30ppm; Operating Temperature: -30℃~+85℃; LCSC Part #: C253914; JLCPCB Part #: C253914; Supplier Footprint: SMD2520-4P

## Sheet SCH - LED Array.SchDoc
size A4; CompanyName: James Cook University; DrawnBy1: Jacob Finger; Organization: James Cook University; Title1: AS1 SCH - LED Array; Revision: 1.2; SheetNumber: 3; SheetTotal: 3; Title2: ARGB LED Array & Power Diode; DrawnBy2: Liam McLaren; ProjectName: *ProjectName
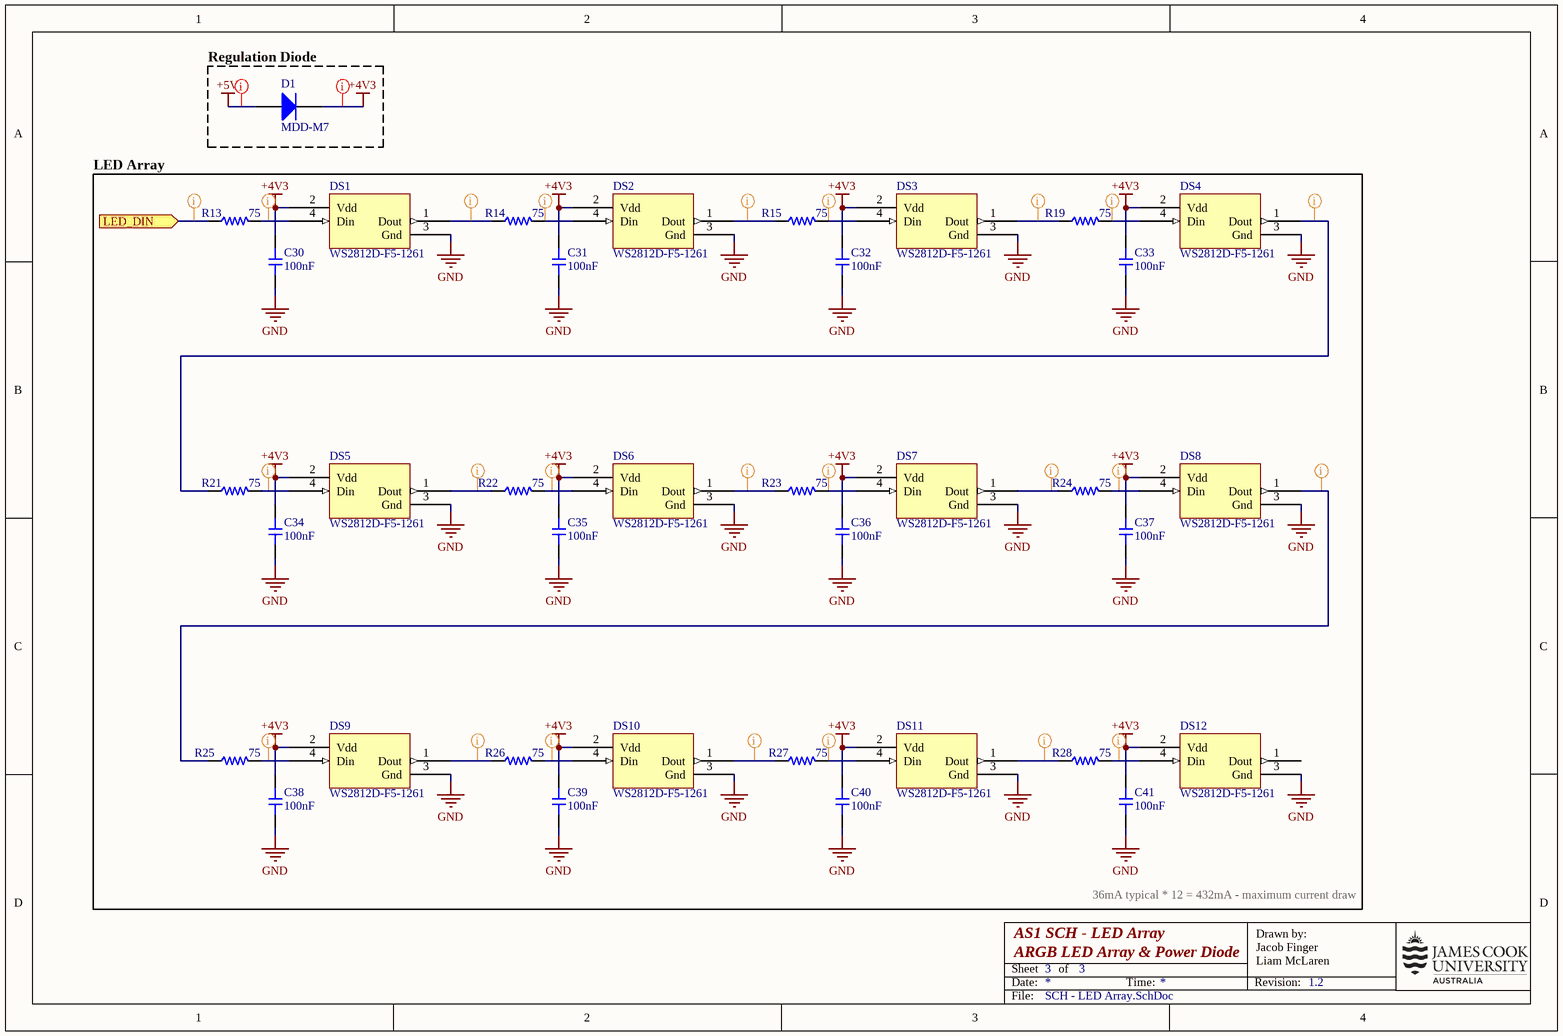
[diagram p2: SCH - LED Array.SchDoc]

### Parts
C30  value 100nF  [CAP-0402]  (hidden comment: CL05B104KO5NNNC)
C31  value 100nF  [CAP-0402]  (hidden comment: CL05B104KO5NNNC)
C32  value 100nF  [CAP-0402]  (hidden comment: CL05B104KO5NNNC)
C33  value 100nF  [CAP-0402]  (hidden comment: CL05B104KO5NNNC)
C34  value 100nF  [CAP-0402]  (hidden comment: CL05B104KO5NNNC)
C35  value 100nF  [CAP-0402]  (hidden comment: CL05B104KO5NNNC)
C36  value 100nF  [CAP-0402]  (hidden comment: CL05B104KO5NNNC)
C37  value 100nF  [CAP-0402]  (hidden comment: CL05B104KO5NNNC)
C38  value 100nF  [CAP-0402]  (hidden comment: CL05B104KO5NNNC)
C39  value 100nF  [CAP-0402]  (hidden comment: CL05B104KO5NNNC)
C40  value 100nF  [CAP-0402]  (hidden comment: CL05B104KO5NNNC)
C41  value 100nF  [CAP-0402]  (hidden comment: CL05B104KO5NNNC)
D1  MDD-M7  [DIOM4227X24M]
DS1  WS2812D-F5-1261  [WS2812D-F5-1261-Footprint-1]  (no BOM)
DS2  WS2812D-F5-1261  [WS2812D-F5-1261-Footprint-1]  (no BOM)
DS3  WS2812D-F5-1261  [WS2812D-F5-1261-Footprint-1]  (no BOM)
DS4  WS2812D-F5-1261  [WS2812D-F5-1261-Footprint-1]  (no BOM)
DS5  WS2812D-F5-1261  [WS2812D-F5-1261-Footprint-1]  (no BOM)
DS6  WS2812D-F5-1261  [WS2812D-F5-1261-Footprint-1]  (no BOM)
DS7  WS2812D-F5-1261  [WS2812D-F5-1261-Footprint-1]  (no BOM)
DS8  WS2812D-F5-1261  [WS2812D-F5-1261-Footprint-1]  (no BOM)
DS9  WS2812D-F5-1261  [WS2812D-F5-1261-Footprint-1]  (no BOM)
DS10  WS2812D-F5-1261  [WS2812D-F5-1261-Footprint-1]  (no BOM)
DS11  WS2812D-F5-1261  [WS2812D-F5-1261-Footprint-1]  (no BOM)
DS12  WS2812D-F5-1261  [WS2812D-F5-1261-Footprint-1]  (no BOM)
R13  value 75  [RES-0603]  (hidden comment: 0603WAF750JT5E)
R14  value 75  [RES-0603]  (hidden comment: 0603WAF750JT5E)
R15  value 75  [RES-0603]  (hidden comment: 0603WAF750JT5E)
R19  value 75  [RES-0603]  (hidden comment: 0603WAF750JT5E)
R21  value 75  [RES-0603]  (hidden comment: 0603WAF750JT5E)
R22  value 75  [RES-0603]  (hidden comment: 0603WAF750JT5E)
R23  value 75  [RES-0603]  (hidden comment: 0603WAF750JT5E)
R24  value 75  [RES-0603]  (hidden comment: 0603WAF750JT5E)
R25  value 75  [RES-0603]  (hidden comment: 0603WAF750JT5E)
R26  value 75  [RES-0603]  (hidden comment: 0603WAF750JT5E)
R27  value 75  [RES-0603]  (hidden comment: 0603WAF750JT5E)
R28  value 75  [RES-0603]  (hidden comment: 0603WAF750JT5E)

### Blocks framed on the sheet
Regulation Diode: D1
LED Array: C30-C41 DS1-DS12 R13-R15 R19 R21-R28

### Ports
LED_DIN (in, see SCH - Inputs and Intermediary[2D])

### Nets
+4V3: C30.2 C31.2 C32.2 C33.2 C34.2 C35.2 C36.2 C37.2 C38.2 C39.2 C40.2 C41.2 D1.1 DS1.2(Vdd) DS2.2(Vdd) DS3.2(Vdd) DS4.2(Vdd) DS5.2(Vdd) DS6.2(Vdd) DS7.2(Vdd) DS8.2(Vdd) DS9.2(Vdd) DS10.2(Vdd) DS11.2(Vdd) DS12.2(Vdd)
+5V: D1.2
GND: C30.1 C31.1 C32.1 C33.1 C34.1 C35.1 C36.1 C37.1 C38.1 C39.1 C40.1 C41.1 DS1.3(Gnd) DS2.3(Gnd) DS3.3(Gnd) DS4.3(Gnd) DS5.3(Gnd) DS6.3(Gnd) DS7.3(Gnd) DS8.3(Gnd) DS9.3(Gnd) DS10.3(Gnd) DS11.3(Gnd) DS12.3(Gnd)
LED_DIN: R13.1 ; port LED_DIN
NetDS1_1: DS1.1(Dout) R14.1
NetDS1_4: DS1.4(Din) R13.2
NetDS2_1: DS2.1(Dout) R15.1
NetDS2_4: DS2.4(Din) R14.2
NetDS3_1: DS3.1(Dout) R19.1
NetDS3_4: DS3.4(Din) R15.2
NetDS4_1: DS4.1(Dout) R21.1
NetDS4_4: DS4.4(Din) R19.2
NetDS5_1: DS5.1(Dout) R22.1
NetDS5_4: DS5.4(Din) R21.2
NetDS6_1: DS6.1(Dout) R23.1
NetDS6_4: DS6.4(Din) R22.2
NetDS7_1: DS7.1(Dout) R24.1
NetDS7_4: DS7.4(Din) R23.2
NetDS8_1: DS8.1(Dout) R25.1
NetDS8_4: DS8.4(Din) R24.2
NetDS9_1: DS9.1(Dout) R26.1
NetDS9_4: DS9.4(Din) R25.2
NetDS10_1: DS10.1(Dout) R27.1
NetDS10_4: DS10.4(Din) R26.2
NetDS11_1: DS11.1(Dout) R28.1
NetDS11_4: DS11.4(Din) R27.2
NetDS12_4: DS12.4(Din) R28.2

Not connected (* = marked no-connect by the designer): DS12 1(Dout)

### Layout directives
net class Power: +4V3, +5V
net class Signals: LED_DIN, NetDS1_1, NetDS1_4, NetDS2_1, NetDS2_4, NetDS3_1, NetDS3_4, NetDS4_1, NetDS4_4, NetDS5_1, NetDS5_4, NetDS6_1, NetDS6_4, NetDS7_1, NetDS7_4, NetDS8_1, NetDS8_4, NetDS9_1, NetDS9_4, NetDS10_1, NetDS10_4, NetDS11_1, NetDS11_4, NetDS12_4

### Notes on the sheet
- 36mA typical * 12 = 432mA - maximum current draw
- Date:
- Sheet
- of
- Time:
- Revision:
- Drawn by:
- File:

### Library data of the parts
C30-C41 = CMP-001-00147-3: as C26 on sheet SCH - Peripheral; Manufacturer Part Number: CL05B104KO5NNNC; ComponentLink1Description: Datasheet; RoHS: Yes; Voltage Rating: 16V; ComponentLink2URL: https://jlcpcb.com/partdetail/C1525; Temperature Coefficient: X7R; ComponentLink2Description: JLCPCB Part URL; JLCPCB Part Number: C1525; ComponentLink3URL: https://lcsc.com/product-detail/Multilayer-Ceramic-Capacitors-MLCC---SMD-SMT_Samsung-Electro-Mechanics-Samsung-Electro-Mechanics-CL05B104KO5NNNC_C1525.html; ComponentLink3Description: LCSC Part URL; Source: jlcpcb_capacitors_basic.schlib; Design Item ID: CL05B104KO5NNNC; Category: Capacitors - MLCC; ComponentLink1URL: https://datasheet.lcsc.com/lcsc/1810191219_Samsung-Electro-Mechanics-CL05B104KO5NNNC_C1525.pdf; JLCPCB Basic Part: Yes; Tolerance: 10%; Case/Package: 0402
D1 = CMP-007-0005-1: General purpose rectifier, 1.0 A, 1 kV, DO-214AC SMD; Manufacturer Part Number: M7; Manufacturer: MDD (Microdiode Electronics); Maximum DC blocking voltage: 1000 V; Maximum forward rectified current: 1.0 A; JLCPCB Part: C95872
DS1-DS12 = CMP-010-0002-2: Through-hole addressable RGB LED, 5mm
R13-R15 R19 R21-R28 = CMP-009-00347-2: Resistor, 75Ω, ±1%, 100mW, 75V, ±200ppm/℃, -55℃~+155℃, SMD 0603; Manufacturer: Uniroyal; Temperature Rating: -55℃~+155℃; Manufacturer Part Number: 0603WAF750JT5E; Tolerance: 1%; JLCPCB Basic Part: Yes; ComponentLink2Description: JLCPCB Part URL; Power Rating: 100mW; ComponentLink1Description: Datasheet; Category: Resistors; JLCPCB Part Number: C4275; Source: jlcpcb_resistors_basic.schlib; Voltage Rating: 75V; ComponentLink2URL: https://jlcpcb.com/partdetail/C4275; ComponentLink1URL: https://datasheet.lcsc.com/lcsc/2206010216_UNI-ROYAL-Uniroyal-Elec-0603WAF750JT5E_C4275.pdf; Case/Package: 0603; Temperature Coefficient: ±200ppm/℃; Design Item ID: 0603WAF750JT5E

## Nets that join several sheets
+3V3: SCH - Inputs and Intermediary (27 pins), SCH - Peripheral (19 pins)
+5V: SCH - Inputs and Intermediary (5 pins), SCH - LED Array (D1.2)
GND: SCH - Inputs and Intermediary (37 pins), SCH - Peripheral (35 pins), SCH - LED Array (24 pins)
IMU1_CS: SCH - Inputs and Intermediary (U2.7), SCH - Peripheral (T20.1 U5.8)
IMU1_INT1: SCH - Inputs and Intermediary (U2.8), SCH - Peripheral (U5.11)
IMU1_INT2: SCH - Inputs and Intermediary (U2.9), SCH - Peripheral (U5.9)
IMU1_MISO: SCH - Inputs and Intermediary (U2.6), SCH - Peripheral (T21.1 U5.7)
IMU1_MOSI: SCH - Inputs and Intermediary (U2.5), SCH - Peripheral (T18.1 U5.6)
IMU1_SCLK: SCH - Inputs and Intermediary (U2.4), SCH - Peripheral (T13.1 U5.4)
IMU2_CS: SCH - Inputs and Intermediary (R6.2), SCH - Peripheral (R2.1 T33.1 U7.12)
IMU2_INT: SCH - Inputs and Intermediary (R9.2), SCH - Peripheral (T26.1 U7.4)
IMU2_MISO: SCH - Inputs and Intermediary (R5.2), SCH - Peripheral (T30.1 U7.1)
IMU2_MOSI: SCH - Inputs and Intermediary (R4.2), SCH - Peripheral (T31.1 U7.14)
IMU2_SCLK: SCH - Inputs and Intermediary (R3.2), SCH - Peripheral (T32.1 U7.13)
LED_DIN: SCH - Inputs and Intermediary (U2.17), SCH - LED Array (R13.1)
MIC_IN: SCH - Inputs and Intermediary (U2.38), SCH - Peripheral (C17.2 R12.2 T19.1 U4.4)
SW1: SCH - Inputs and Intermediary (U2.18), SCH - Peripheral (C26.2 R20.2 S2.C S2.D)

## Assembly variants
JLCPCB Assembly: not fitted DS1 DS2 DS3 DS4 DS5 DS6 DS7 DS8 DS9 DS10 DS11 DS12 F1 F2 F3 P1 P2 P3 P4